# EAGLE design battery series (EAGLE 5.07)
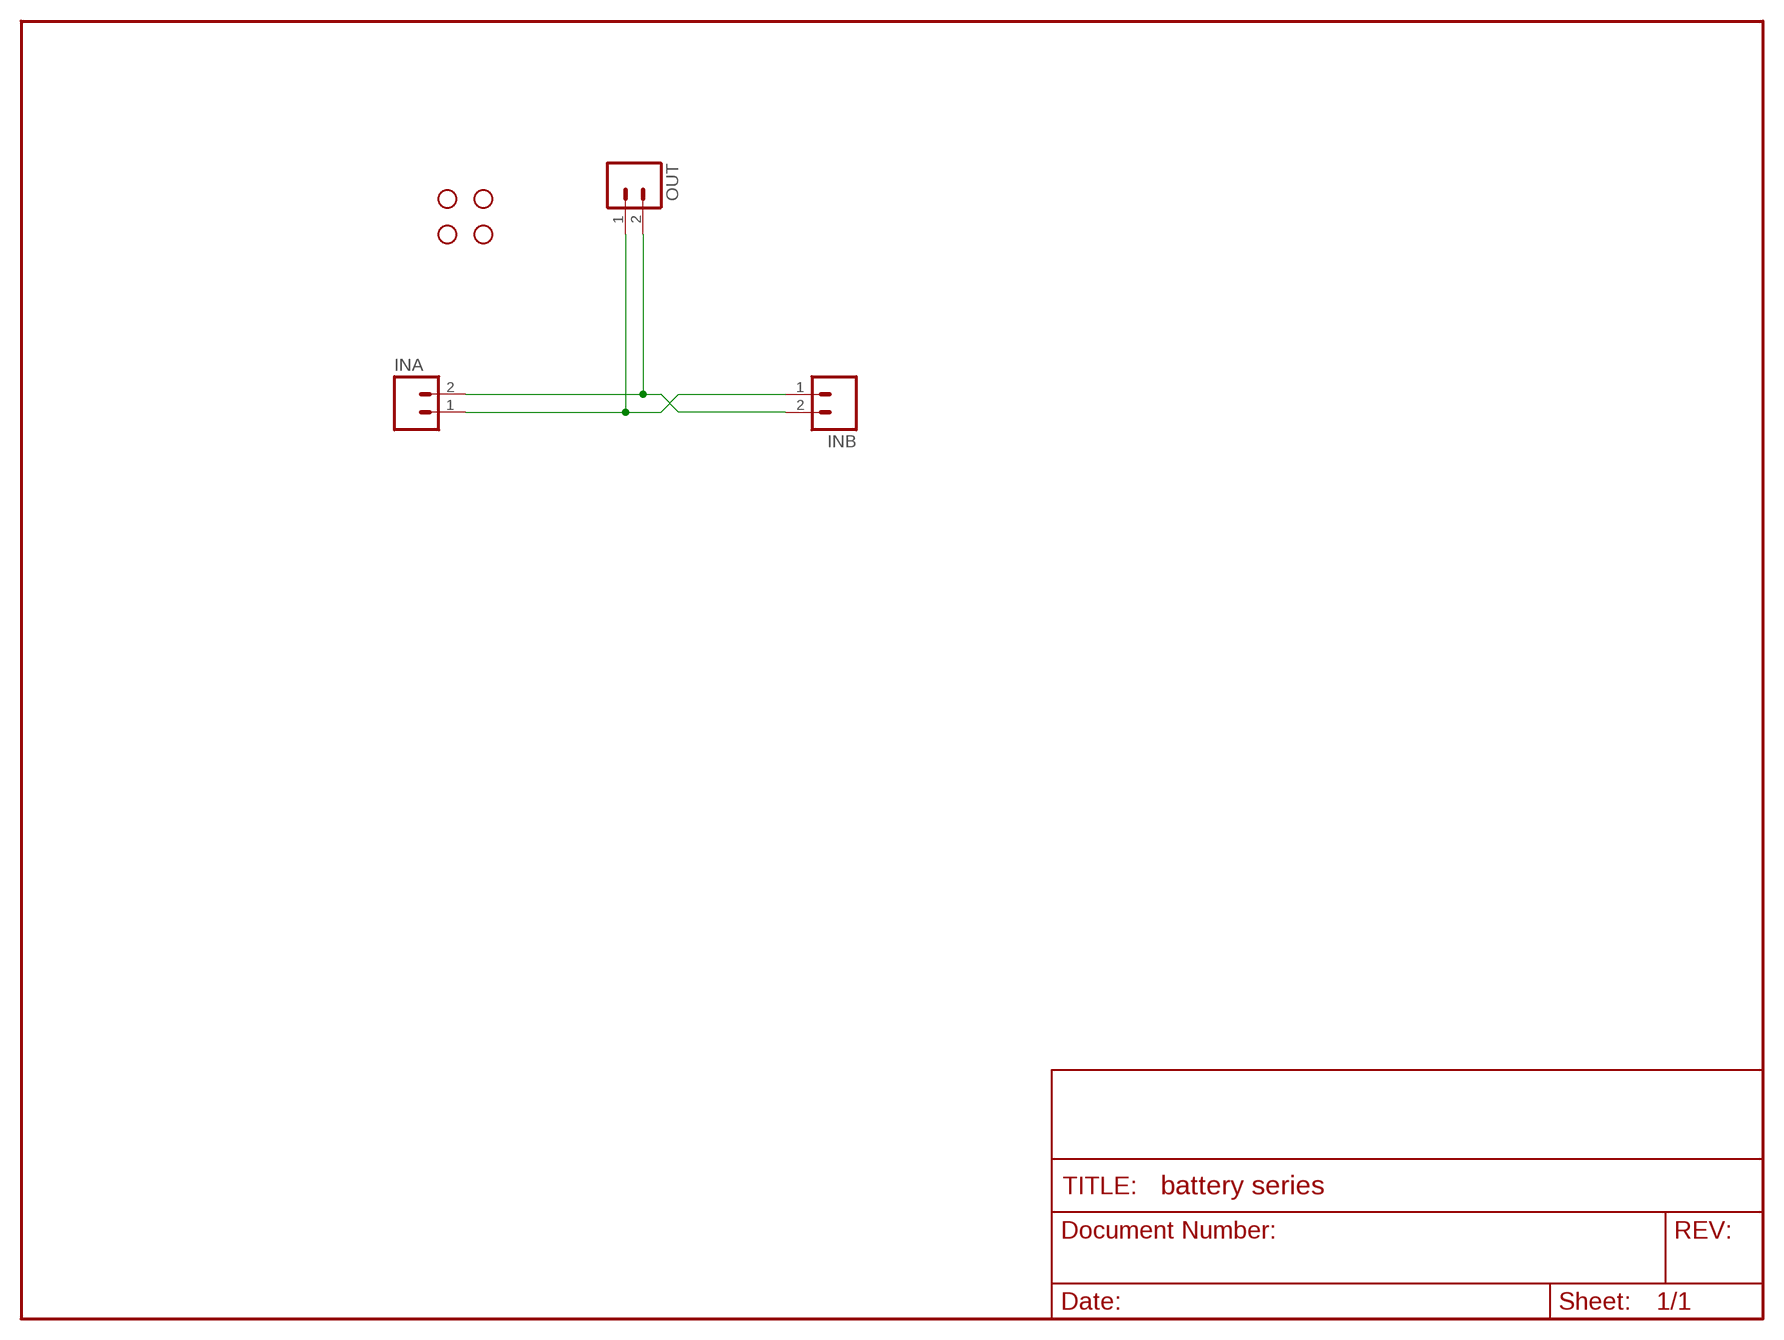
[diagram p0: schematic, sheet 1]

## Parts
INA  M02-JST-2MM-SMT  [S2B-PH]
INB  M02-JST-2MM-SMT  [S2B-PH]
JP1  STAND-OFF  [STAND-OFF]
JP2  STAND-OFF  [STAND-OFF]
JP3  STAND-OFF  [STAND-OFF]
JP4  STAND-OFF  [STAND-OFF]
OUT  M02-JST-2MM-SMT  [S2B-PH]

## Nets
N$1: INA.2 INB.2 OUT.2
N$3: INA.1 INB.1 OUT.1

## Library data of the parts
INA INB OUT = SparkFun:M02: Header 2 Standard 2-pin 0.1" header. Use with straight break away headers (SKU : PRT-00116), right angle break away headers (PRT-00553), swiss pins (PRT-00743), machine pins (PRT-00117), and female headers (PRT-00115). Molex polarized connector foot print use with SKU : PRT-08233 with associated crimp pins and housings.
JP1-JP4 = SparkFun:STAND-OFF: Stand Off This is the mechanical footprint for a #4 phillips button head screw. Use the keepout ring to avoid running the screw head into surrounding components. SKU : PRT-00447

## Board
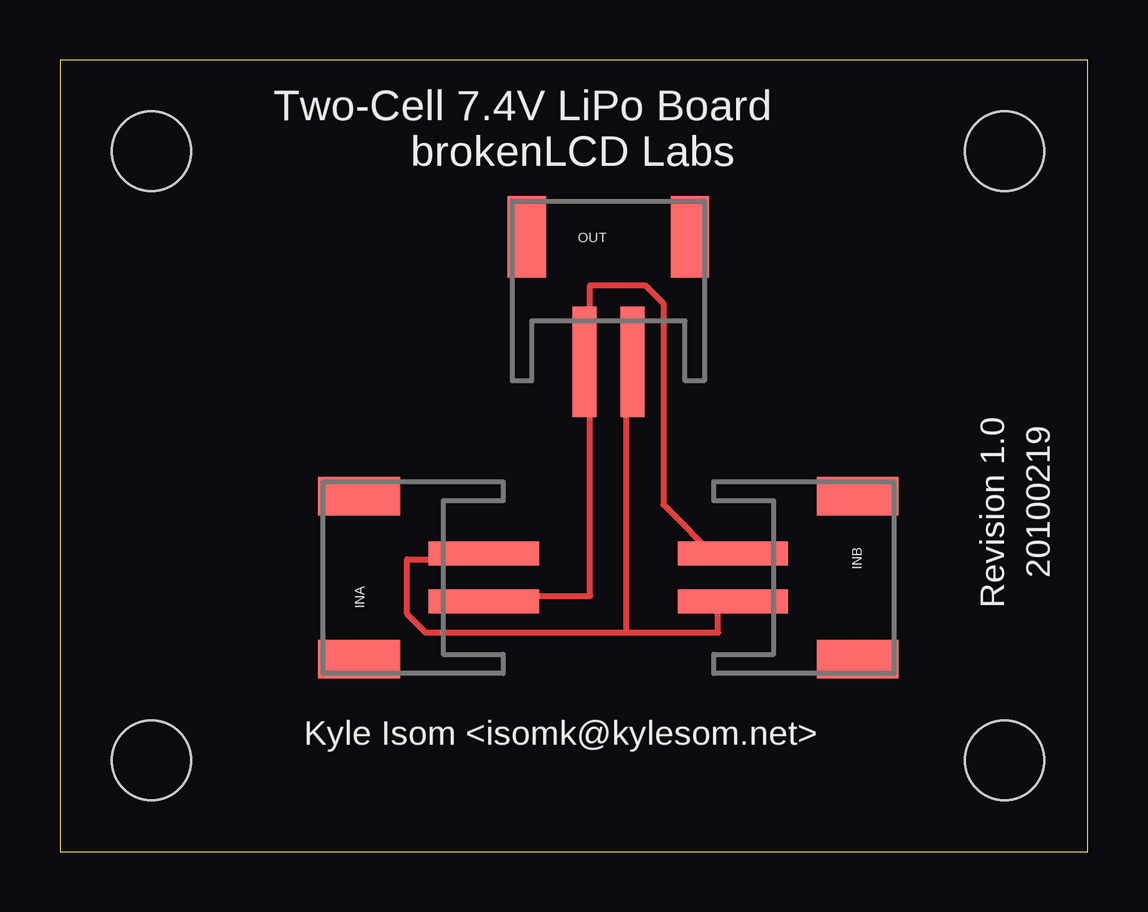
[diagram p1: board, top side]

Size 42.85 x 33.01 mm. Coordinates in mm from the lower left corner, seen from the top.
Outline: 0,0 42.85,0 42.85,33.01 0,33.01 0,0
Copper layers (1*16): Top 0.035mm / dielectric 1.5mm / Bottom 0.035mm
Design rules "default": minimum track width 10mil, minimum drill 24mil, track to track 8mil, track to pad 8mil, pad to pad 8mil, via to via 8mil, smd to smd 8mil, copper to edge 40mil, drill to drill 8mil, minimum pad ring 10mil, minimum via ring 8mil, stop-mask expansion 4mil, vias tented up to drill 0mil, thermal gap 10mil

### Footprints (pad centres in the part's own frame; a part is rotated, then mirrored left to right if it is on the bottom)
S2B-PH = smd 1 x 4.6: 1 -1,-3.7; 2 1,-3.7 | smd 1.6 x 3.4: NC1 -3.4,1.5; NC2 3.4,1.5
STAND-OFF = hole 3.302: 0,0

### Placement (x,y rotation side)
INA  13.97,11.43 90 top
INB  31.75,11.43 270 top
JP1  3.81,3.81 0 top
JP2  39.37,3.81 0 top
JP3  3.81,29.21 0 top
JP4  39.37,29.21 0 top
OUT  22.86,24.13 0 top

### Tracks (layer width: path | path; a pad name or v marks a point on that pad's centre or on a via)
N$1
  Top 0.254: 23.62,9.14 27.43,9.14 27.43,10.67 INB.2 | 23.62,9.14 15.24,9.14 14.48,9.91 14.48,12.19 17.53,12.19 INA.2 | 23.62,9.14 23.62,19.81 OUT.2
N$3
  Top 0.254: INA.1 18.29,10.67 22.1,10.67 22.1,19.81 OUT.1 22.1,20.57 22.1,23.62 24.38,23.62 25.15,22.86 25.15,14.48 27.43,12.19 INB.1

### Text on the board
tPlace: Two-Cell 7.4V LiPo Board | brokenLCD Labs | 20100219 | Revision 1.0 | Kyle Isom <isomk@kylesom.net>